# Altium project template.PrjPcb
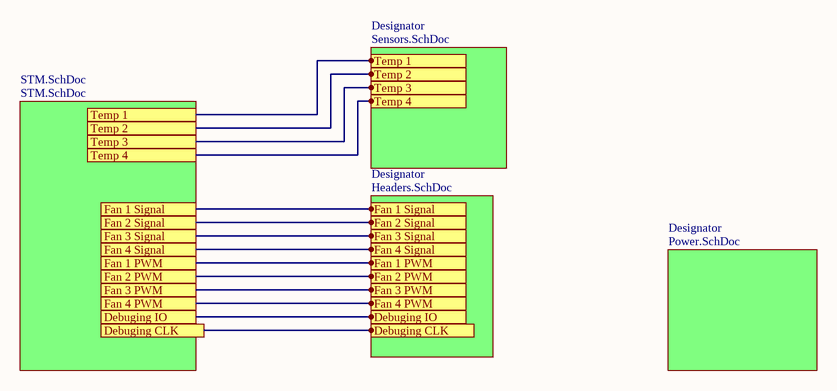
[diagram p0: TOP.SchDoc]
3 sheets, 17 parts. Net scope: hierarchical (ports join the sheet entries above them; power ports are global).
Board file: PCB.PcbDoc
Sheets:
  TOP.SchDoc
    Designator = Power.SchDoc
  CANsetup.SchDoc

## Sheet TOP.SchDoc: =DocumentName
size A4; Organization: Queen's Formula SAE; Address1: 130 Stuart St, Kingston; Address2: Ontario; Address3: Canada; Address4: K7L 2V9; DocumentNumber: 1; Revision: 0; SheetNumber: 1; SheetTotal: 1

### Sub-sheets
Designator = Sensors.SchDoc (file not in this document): Temp 1, Temp 2, Temp 3, Temp 4
Designator = Power.SchDoc: no entries
Designator = Headers.SchDoc (file not in this document): Fan 1 Signal, Fan 2 Signal, Fan 3 Signal, Fan 4 Signal, Fan 1 PWM, Fan 2 PWM, Fan 3 PWM, Fan 4 PWM, Debuging IO, Port
STM.SchDoc = STM.SchDoc (file not in this document): no entries

### Ports
Debuging CLK, Debuging IO, Fan 1 PWM, Fan 1 Signal, Fan 2 PWM, Fan 2 Signal, Fan 3 PWM, Fan 3 Signal, Fan 4 PWM, Fan 4 Signal, Temp 1, Temp 2, Temp 3, Temp 4

### Nets
Debuging CLK: port Debuging CLK, sheet Designator/Port
Debuging IO: port Debuging IO, sheet Designator/Debuging IO
Fan 1 PWM: port Fan 1 PWM, sheet Designator/Fan 1 PWM
Fan 1 Signal: port Fan 1 Signal, sheet Designator/Fan 1 Signal
Fan 2 PWM: port Fan 2 PWM, sheet Designator/Fan 2 PWM
Fan 2 Signal: port Fan 2 Signal, sheet Designator/Fan 2 Signal
Fan 3 PWM: port Fan 3 PWM, sheet Designator/Fan 3 PWM
Fan 3 Signal: port Fan 3 Signal, sheet Designator/Fan 3 Signal
Fan 4 PWM: port Fan 4 PWM, sheet Designator/Fan 4 PWM
Fan 4 Signal: port Fan 4 Signal, sheet Designator/Fan 4 Signal
Temp 1: port Temp 1, sheet Designator/Temp 1
Temp 2: port Temp 2, sheet Designator/Temp 2
Temp 3: port Temp 3, sheet Designator/Temp 3
Temp 4: port Temp 4, sheet Designator/Temp 4

### Notes on the sheet
- Title
- Size:
- Date:
- A4
- Number:
- Time:
- Revision:
- Sheet
- of
- File:

## Sheet Power.SchDoc
size A4
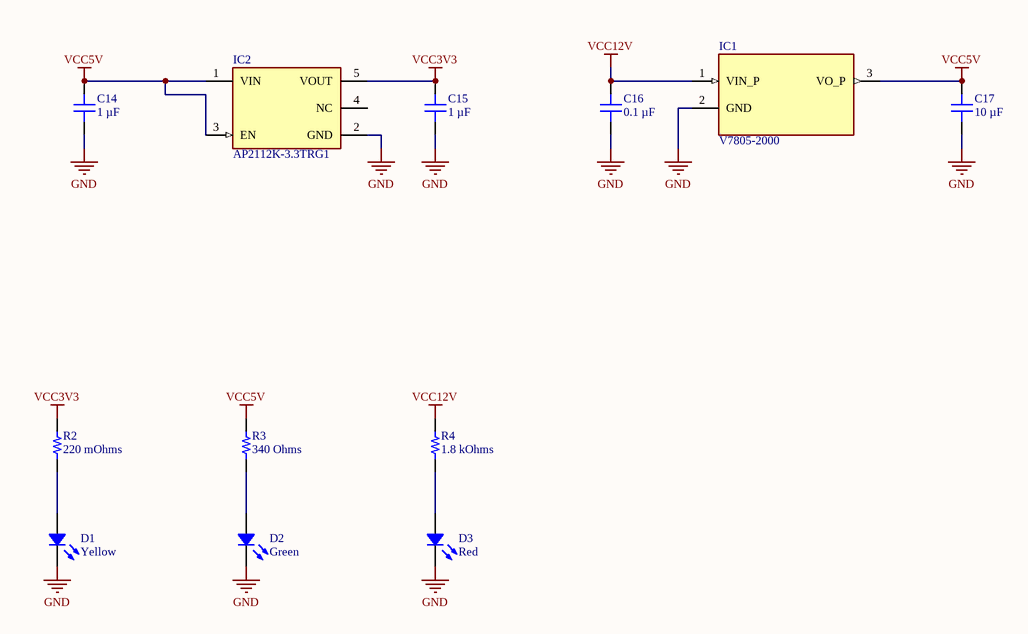
[diagram p1: Power.SchDoc]

### Parts
C14  1 µF  [CAP 0201_0603]
C15  1 µF  [CAP 0201_0603]
C16  0.1 µF  [CAP 0201_0603]
C17  10 µF  [CAP 0402_1005]
D1  Yellow  [LED 1206_3216 YELLOW]
D2  Green  [LED 0805_2012 GREEN]
D3  Red  [LED 1206_3216 RED]
IC1  V7805-2000  [CONV_V7805-2000]
IC2  AP2112K-3.3TRG1  [FP-SOT25-IPC_A]
R2  220 mOhms  [RES 0201_0603]
R3  340 Ohms  [RES 0201_0603]
R4  1.8 kOhms  [RES 0201_0603]

### Nets
GND: C14.1 C15.1 C16.1 C17.1 D1.2 D2.2 D3.2 IC1.2(GND) IC2.2(GND)
VCC3V3: C15.2 IC2.5(VOUT) R2.2
VCC5V: C14.2 C17.2 IC1.3(VO_P) IC2.1(VIN) IC2.3(EN) R3.2
VCC12V: C16.2 IC1.1(VIN_P) R4.2
NetD1_1: D1.1 R2.1
NetD2_1: D2.1 R3.1
NetD3_1: D3.1 R4.1

Not connected (* = marked no-connect by the designer): IC2 4(NC)

### Library data of the parts
C14 C15 = CL03A105MQ3CSNC: CAP CER 1UF 6.3V X5R 0201; manufacturer: Samsung Electro-Mechanics; Tolerance: ±20%; Part Number: CL03A105MQ3CSNC; Value: 1 µF; Applications: General Purpose; Capacitance: 1 µF; componentlink1description: Datasheet; componentlink1url: http://www.samsungsem.com/kr/support/product-search/mlcc/CL03A105MQ3CSNC.jsp; componentlink2description: DigiKey Link; componentlink2url: https://www.digikey.com/en/products/detail/samsung-electro-mechanics/CL03A105MQ3CSNC/3886983; Device Package: 0201 (0603 Metric); lastupdated: 2024-01-11 8:00:55 PM; Lifecycle Status: Active; Minimum Order: 1; Mounting Type: Surface Mount, MLCC; Operating Temperature: -55°C ~ 85°C; Package / Case: 0201 (0603 Metric); packaging: TapeAndReel; partid: 93; Part Status: Active; price: 0.01; series: CL; Size / Dimension: 0.024" L x 0.012" W (0.60mm x 0.30mm); Supplier 1: DigiKey; Supplier Part Number 1: 1276-1325-1-ND; Temperature Coefficient: X5R; Thickness (Max): 0.013" (0.33mm); Voltage - Rated: 6.3V
C16 = EMK063BJ104MP-F: CAP CER 0.1UF 16V X5R 0201; manufacturer: Taiyo Yuden; Tolerance: ±20%; Part Number: EMK063BJ104MP-F; Value: 0.1 µF; Applications: SMPS Filtering; Capacitance: 0.1 µF; componentlink1description: Datasheet; componentlink1url: https://ds.yuden.co.jp/TYCOMPAS/ut/detail?pn=EMK063BJ104MP-F &u=M; componentlink2description: DigiKey Link; componentlink2url: https://www.digikey.com/en/products/detail/taiyo-yuden/EMK063BJ104MP-F/7403527; Device Package: 0201 (0603 Metric); lastupdated: 2024-01-11 8:00:55 PM; Lifecycle Status: Active; Minimum Order: 1; Mounting Type: Surface Mount, MLCC; Operating Temperature: -55°C ~ 85°C; Package / Case: 0201 (0603 Metric); packaging: CutTape; partid: 79; Part Status: Active; price: 0.01; series: M; Size / Dimension: 0.024" L x 0.012" W (0.60mm x 0.30mm); Supplier 1: DigiKey; Supplier Part Number 1: 587-6302-1-ND; Temperature Coefficient: X5R; Thickness (Max): 0.015" (0.39mm); Voltage - Rated: 16V
C17 = CL05A106MP8NUB8: CAP CER 10UF 10V X5R 0402; manufacturer: Samsung Electro-Mechanics; Tolerance: ±20%; Part Number: CL05A106MP8NUB8; Value: 10 µF; Applications: Acoustic Noise Reduction; Capacitance: 10 µF; componentlink1description: Datasheet; componentlink1url: http://www.samsungsem.com/kr/support/product-search/mlcc/CL05A106MP8NUB8.jsp; componentlink2description: DigiKey Link; componentlink2url: https://www.digikey.com/en/products/detail/samsung-electro-mechanics/CL05A106MP8NUB8/5961314; Device Package: 0402 (1005 Metric); lastupdated: 2024-01-11 8:04:27 PM; Lifecycle Status: Active; Minimum Order: 1; Mounting Type: Surface Mount, MLCC; Operating Temperature: -55°C ~ 85°C; Package / Case: 0402 (1005 Metric); packaging: TapeAndReel; partid: 1758; Part Status: Active; price: 0.06; series: CL; Size / Dimension: 0.039" L x 0.020" W (1.00mm x 0.50mm); Supplier 1: DigiKey; Supplier Part Number 1: 1276-6830-1-ND; Temperature Coefficient: X5R; Thickness (Max): 0.035" (0.90mm); Voltage - Rated: 10V
D1 = 25-21UYC/S530-A2/TR8: LED YELLOW CLEAR 2SMD; Manufacturer: Everlight Electronics Co Ltd; Configuration: Standard; Current - Test: 20mA; Lens Color: Colorless; Lens Size: 1.10mm Dia; Lens Style: Round with Domed Top; Millicandela Rating: 45mcd; Viewing Angle: 60°; Voltage - Forward (Vf) (Typ): 2V; Wavelength - Dominant: 589nm; Wavelength - Peak: 591nm; Part Number: 25-21UYC/S530-A2/TR8; Color: Yellow; ComponentLink1Description: Datasheet; ComponentLink1URL: //media.digikey.com/pdf/Data%20Sheets/Everlight%20PDFs/25-21UYC-S530-A2-TR8_V6_11-12-18.pdf; ComponentLink2Description: DigiKey Link; ComponentLink2URL: https://www.digikey.com/en/products/detail/everlight-electronics-co-ltd/25-21UYC-S530-A2-TR8/8535289; Device Package: 1206 (3216 Metric); Height (Max): 1.20mm; LastUpdated: 2023-08-19 8:22:38 PM; Lens Transparency: Clear; Lifecycle Status: Active; Minimum Order: 1; Mounting Type: Surface Mount; Package / Case: 1206 (3216 Metric); Packaging: TapeAndReel; PartId: 2; Part Status: Active; Price: 0.08; Series: -; Size / Dimension: 3.20mm L x 1.60mm W; Supplier 1: DigiKey; Supplier Part Number 1: 1080-1595-1-ND; Supplier Device Package: 2-SMD; Value: Yellow
D2 = QTLP630C4TR: LED GREEN CLEAR 0805 SMD; Manufacturer: Everlight Electronics Co Ltd; Configuration: Standard; Current - Test: 20mA; Lens Color: Colorless; Lens Size: 1.40mm x 1.25mm; Lens Style: Rectangle with Flat Top; Millicandela Rating: 10mcd; Viewing Angle: 140°; Voltage - Forward (Vf) (Typ): 2.1V; Wavelength - Dominant: 570nm; Wavelength - Peak: 565nm; Part Number: QTLP630C4TR; Color: Green; ComponentLink1Description: Datasheet; ComponentLink1URL: //media.digikey.com/PDF/Data%20Sheets/Everlight%20PDFs/QTLP630-2.pdf; ComponentLink2Description: DigiKey Link; ComponentLink2URL: https://www.digikey.com/en/products/detail/everlight-electronics-co-ltd/QTLP630C4TR/2675902; Device Package: 0805 (2012 Metric); Height (Max): 1.20mm; LastUpdated: 2023-08-19 8:21:40 PM; Lens Transparency: Clear; Lifecycle Status: Active; Minimum Order: 1; Mounting Type: Surface Mount; Package / Case: 0805 (2012 Metric); Packaging: TapeAndReel; PartId: 240; Part Status: Active; Price: 0.05; Series: -; Size / Dimension: 2.00mm L x 1.25mm W; Supplier 1: DigiKey; Supplier Part Number 1: 1080-1411-1-ND; Supplier Device Package: 0805; Value: Green
D3 = XZMDK55W-A2RT: LED RED CLEAR 2SMD; Manufacturer: SunLED; Configuration: Standard; Current - Test: 20mA; Lens Color: Colorless; Lens Size: 1.10mm Dia; Lens Style: Round with Flat Top; Millicandela Rating: 228mcd; Viewing Angle: 70°; Voltage - Forward (Vf) (Typ): 1.95V; Wavelength - Dominant: 630nm; Wavelength - Peak: 645nm; Part Number: XZMDK55W-A2RT; Color: Red; ComponentLink1Description: Datasheet; ComponentLink1URL: https://www.sunledusa.com/products/spec/XZMDK55W-A2RT.pdf; ComponentLink2Description: DigiKey Link; ComponentLink2URL: https://www.digikey.com/en/products/detail/sunled/XZMDK55W-A2RT/5775264; Device Package: 1206 (3216 Metric); Height (Max): 1.20mm; LastUpdated: 2023-08-19 8:21:50 PM; Lens Transparency: Clear; Lifecycle Status: Active; Minimum Order: 1; Mounting Type: Surface Mount; Package / Case: 1206 (3216 Metric); Packaging: TapeAndReel; PartId: 183; Part Status: Active; Price: 0.06; Series: -; Size / Dimension: 3.20mm L x 1.60mm W; Supplier 1: DigiKey; Supplier Part Number 1: 1497-1289-1-ND; Supplier Device Package: 2-SMD; Value: Red
IC1 = V7805-2000: 2 A Output Current, 4.75~18 Vdc Input, 3 Pin SIP, Non-Isolated, Dc-Dc Converter; MF: CUI Inc.; DigiKey-Purchase-URL: https://snapeda.com/shop?store=DigiKey&id=2773183; Package: SIP-3 CUI; Value: *; MP: V7805-2000; CUI_purchase_URL: https://www.cui.com/product/dc-dc-converters/non-isolated/v78-2000-series?utm_source=snapeda.com&utm_medium=referral&utm_campaign=snapedaBOM; SnapEDA_Link: https://www.snapeda.com/parts/V7805-2000/CUI/view-part/2773183/?ref=snap; Digi-Key_Part_Number: 102-2188-ND
IC2 = CMP-12756-000035-1: IC REG LINEAR 3.3V 600MA SOT25; Number of Regulators: 1; Output Type: Fixed; Polarity: Positive; Min Input Voltage: 2.5V; Max Input Voltage: 6V; Accuracy: 1.5%; Quiescent Current: 55uA; Dropout Voltage: 250mV; Min Operating Temperature: -40°C; Length: 3.1mm; Output Current: 600mA; Max Operating Temperature: 85°C; Package Quantity: 1; Output Voltage: 3.3V; Width: 1.7mm; Number of Outputs: 1; Packaging: Tape and Reel; Height: 1.3mm; Lead Free: Lead Free; Max Output Current: 600mA; Case/Package: SOT-23-5; Mount: Surface Mount; Number of Pins: 5
R2 = UCR006YVPFLR220: RES 0.22 OHM 1% 1/10W 0201; Manufacturer: Rohm Semiconductor; Power (Watts): 0.1W, 1/10W; Temperature Coefficient: 0/ +300ppm/°C; Part Number: UCR006YVPFLR220; Value: 220 mOhms; ComponentLink1Description: Datasheet; ComponentLink1URL: https://www.rohm.com/datasheet/UCR10EVHJS/ucr-e; ComponentLink2Description: DigiKey Link; ComponentLink2URL: https://www.digikey.com/en/products/detail/rohm-semiconductor/UCR006YVPFLR220/5247873; Composition: Thick Film; Device Package: 0201 (0603 Metric); Features: Current Sense; Height - Seated (Max): 0.011" (0.28mm); LastUpdated: 2023-08-19 7:17:26 PM; Lifecycle Status: Active; Minimum Order: 1; Number of Terminations: 2; Operating Temperature: -55°C ~ 155°C; Package / Case: 0201 (0603 Metric); Packaging: TapeAndReel; PartId: 108; Part Status: Active; Price: 0.12; Resistance: 220 mOhms; Series: UCR; Size / Dimension: 0.024" L x 0.013" W (0.60mm x 0.33mm); Supplier 1: DigiKey; Supplier Part Number 1: RHM1702-1-ND; Supplier Device Package: 0201; Tolerance: ±1%
R3 = AC0201FR-07340RL: RES SMD 340 OHM 1% 1/20W 0201; Manufacturer: Yageo; Power (Watts): 0.05W, 1/20W; Temperature Coefficient: ±200ppm/°C; Part Number: AC0201FR-07340RL; Value: 340 Ohms; ComponentLink1Description: Datasheet; ComponentLink1URL: https://www.yageo.com/upload/media/product/productsearch/datasheet/rchip/PYu-AC_51_RoHS_L_7.pdf; ComponentLink2Description: DigiKey Link; ComponentLink2URL: https://www.digikey.com/en/products/detail/yageo/AC0201FR-07340RL/5894560; Composition: Thick Film; Device Package: 0201 (0603 Metric); Features: Automotive AEC-Q200, Moisture Resistant; Height - Seated (Max): 0.010" (0.26mm); LastUpdated: 2023-08-19 7:17:26 PM; Lifecycle Status: Active; Minimum Order: 1; Number of Terminations: 2; Operating Temperature: -55°C ~ 155°C; Package / Case: 0201 (0603 Metric); Packaging: TapeAndReel; PartId: 145; Part Status: Active; Price: 0.01; Ratings: AEC-Q200; Resistance: 340 Ohms; Series: AC; Size / Dimension: 0.024" L x 0.012" W (0.60mm x 0.30mm); Supplier 1: DigiKey; Supplier Part Number 1: YAG5199CT-ND; Supplier Device Package: 0201; Tolerance: ±1%
R4 = CRCW02011K80JNED: RES SMD 1.8K OHM 5% 1/20W 0201; Manufacturer: Vishay Dale; Power (Watts): 0.05W, 1/20W; Temperature Coefficient: ±200ppm/°C; Part Number: CRCW02011K80JNED; Value: 1.8 kOhms; ComponentLink1Description: Datasheet; ComponentLink1URL: http://www.vishay.com/docs/20052/crcw0201e3.pdf; ComponentLink2Description: DigiKey Link; ComponentLink2URL: https://www.digikey.com/en/products/detail/vishay-dale/CRCW02011K80JNED/1199542; Composition: Thick Film; Device Package: 0201 (0603 Metric); Height - Seated (Max): 0.010" (0.26mm); LastUpdated: 2023-08-19 7:17:24 PM; Lifecycle Status: Active; Minimum Order: 1; Number of Terminations: 2; Operating Temperature: -55°C ~ 155°C; Package / Case: 0201 (0603 Metric); Packaging: CutTape; PartId: 479; Part Status: Active; Price: 0.01; Resistance: 1.8 kOhms; Series: CRCW; Size / Dimension: 0.024" L x 0.012" W (0.60mm x 0.30mm); Supplier 1: DigiKey; Supplier Part Number 1: 541-CRCW02011K80JNEDCT-ND; Supplier Device Package: 0201; Tolerance: ±5%

## Sheet CANsetup.SchDoc
size A4
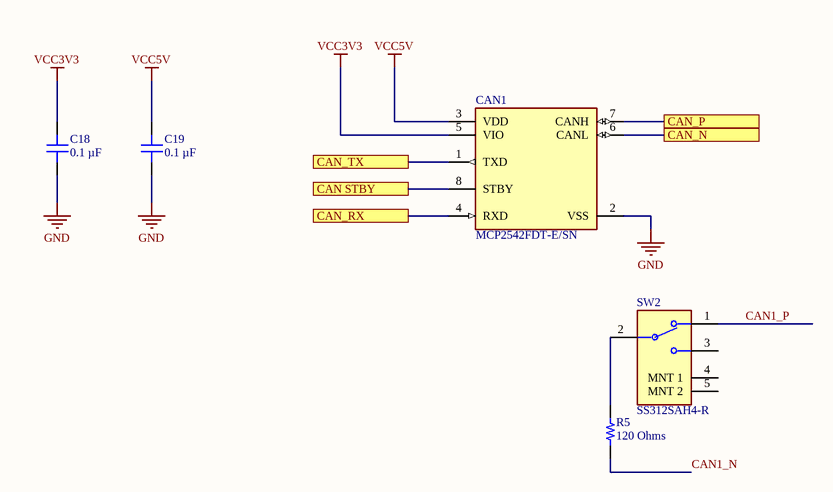
[diagram p2: CANsetup.SchDoc]

### Parts
C18  0.1 µF  [CAP 01005_0402]
C19  0.1 µF  [CAP 01005_0402]
CAN1  MCP2542FDT-E/SN  [FP-C04-057-SN-IPC_C]
R5  120 Ohms  [RES 0201_0603]
SW2  SS312SAH4-R  [FP-SS312SAH4-R-MFG]

### Ports
CAN STBY, CAN_N, CAN_P, CAN_RX, CAN_TX

### Nets
GND: C18.2 C19.2 CAN1.2(VSS)
VCC3V3: C18.1 CAN1.5(VIO)
VCC5V: C19.1 CAN1.3(VDD)
CAN1_N: R5.2
CAN1_P: SW2.1
CAN STBY: CAN1.8(STBY) ; port CAN STBY
CAN_N: CAN1.6(CANL) ; port CAN_N
CAN_P: CAN1.7(CANH) ; port CAN_P
CAN_RX: CAN1.4(RXD) ; port CAN_RX
CAN_TX: CAN1.1(TXD) ; port CAN_TX
NetR5_1: R5.1 SW2.2(COM)

Not connected (* = marked no-connect by the designer): SW2 3 4(MNT_1) 5(MNT_2)

### Library data of the parts
C18 C19 = CL02A104KQ2NNNC: CAP CER 0.1UF 6.3V X5R 01005; manufacturer: Samsung Electro-Mechanics; Tolerance: ±10%; Part Number: CL02A104KQ2NNNC; Value: 0.1 µF; Applications: General Purpose; Capacitance: 0.1 µF; componentlink1description: Datasheet; componentlink1url: http://www.samsungsem.com/kr/support/product-search/mlcc/CL02A104KQ2NNNC.jsp; componentlink2description: DigiKey Link; componentlink2url: https://www.digikey.com/en/products/detail/samsung-electro-mechanics/CL02A104KQ2NNNC/3886867; Device Package: 01005 (0402 Metric); lastupdated: 2023-11-30 9:46:05 PM; Lifecycle Status: Active; Minimum Order: 1; Mounting Type: Surface Mount, MLCC; Operating Temperature: -55°C ~ 85°C; Package / Case: 01005 (0402 Metric); packaging: TapeAndReel; Part Status: Active; price: 0.02; series: CL; Size / Dimension: 0.016" L x 0.008" W (0.40mm x 0.20mm); Supplier 1: DigiKey; Supplier Part Number 1: 1276-1209-1-ND; Temperature Coefficient: X5R; Thickness (Max): 0.009" (0.22mm); Voltage - Rated: 6.3V
CAN1 = CMP-06279-000006-1: IC TRANSCEIVER 1/1 8SOIC; Data Rate: 8Mbps; Receiver Hysteresis: 200mV; Min Operating Temperature: -40°C; Mount: Surface Mount; Case/Package: SOIC; Max Operating Temperature: 125°C; Packaging: Rail/Tube
R5 = RMCF0201JT120R: RES 120 OHM 5% 1/20W 0201; Manufacturer: Stackpole Electronics Inc; Power (Watts): 0.05W, 1/20W; Temperature Coefficient: ±200ppm/°C; Part Number: RMCF0201JT120R; Value: 120 Ohms; ComponentLink1Description: Datasheet; ComponentLink1URL: https://www.seielect.com/catalog/sei-rmcf_rmcp.pdf; ComponentLink2Description: DigiKey Link; ComponentLink2URL: https://www.digikey.com/en/products/detail/stackpole-electronics-inc/RMCF0201JT120R/5966040; Composition: Thick Film; Device Package: 0201 (0603 Metric); Height - Seated (Max): 0.010" (0.26mm); LastUpdated: 2023-11-30 8:20:29 PM; Lifecycle Status: Active; Minimum Order: 1; Number of Terminations: 2; Operating Temperature: -55°C ~ 155°C; Package / Case: 0201 (0603 Metric); Packaging: CutTape; PartId: 197; Part Status: Active; Price: 0.01; Ratings: AEC-Q200; Resistance: 120 Ohms; Series: RMCF; Size / Dimension: 0.024" L x 0.012" W (0.60mm x 0.30mm); Supplier 1: DigiKey; Supplier Part Number 1: 738-RMCF0201JT120RCT-ND; Supplier Device Package: 0201; Tolerance: ±5%
SW2 = CMP-31746-000001-1: SWITCH SLIDE SPDT 0.4VA 28V; Mechanical Life: 10000Cycles; Switch Function: On-On; Actuator Length: 2mm; Contact Style: Shorting; Max Current Rating: 100mA; Actuator Type: Standard; Actuator Material: Polyphenylene; Length: 10.5mm; Orientation: Right Angle; Voltage Rating (DC): 28V; Contact Material: Bronze; Electrical Life: 10000Cycles; Max Operating Temperature: 85°C; Case/Package: SMD/SMT; Depth: 7.45mm; Contact Plating: Gold; Voltage Rating (AC): 28V; Package Quantity: 1; Min Operating Temperature: -25°C; Switch Travel: 2mm; Housing Material: Bronze; RoHS Compliant: Yes; Lead Free: Lead Free; Termination: Gull Wing; Packaging: Tape and Reel; REACH SVHC: No SVHC; Mount: Surface Mount; Series: SS3; Throw Configuration: SPDT; Max Voltage Rating (AC): 28V; Max Voltage Rating (DC): 28V

## Nets that join several sheets
GND: Power (9 pins), CANsetup (C18.2 C19.2 CAN1.2)
VCC3V3: Power (C15.2 IC2.5 R2.2), CANsetup (C18.1 CAN1.5)
VCC5V: Power (6 pins), CANsetup (C19.1 CAN1.3)